# EAGLE schematic detector02 (EAGLE 6.1)
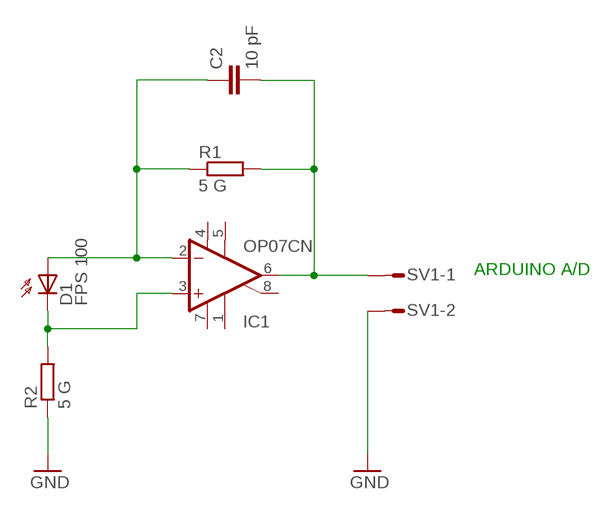
[diagram p0: schematic, sheet 1]

## Parts
C2  10 pF  C-EU050-025X075  [C050-025X075]
D1  FPS 100  BP104  [BP104]
IC1  OP07CN  [DIL08]
R1  5 G  R-EU_0207/7  [0207/7]
R2  5 G  R-EU_0207/7  [0207/7]
SV1  L02P  [L02P]

## Nets
GND: R2.1 SV1.2
N$1: C2.1 D1.A IC1.2(-IN) R1.1
N$2: D1.K(C) IC1.3(+IN) R2.2
N$3: C2.2 IC1.6(OUT) R1.2 SV1.1
Unconnected: IC1.1(ON1) IC1.5(OPT) IC1.8(ON2)

## Notes on the sheet
- ARDUINO A/D

## Power pins joined to a net without a drawn wire
V+: IC1.7(V+)
V-: IC1.4(V-)

## Library data of the parts
C2 = rcl:C-EU: CAPACITOR, European symbol
D1 = opto-trans-siemens:BP104: PHOTO DIODE; MF: VISHAY/TELEFUNKEN; MPN: BP104; OC_FARNELL: 1779636; OC_NEWARK: 14M4504
IC1 = linear:OP07*: OP AMP
R1 R2 = rcl:R-EU_: RESISTOR, European symbol
SV1 = con-amp-mt:L02P: AMP MT CONNECTOR; OC_FARNELL: unknown; OC_NEWARK: unknown